# EAGLE schematic Opto Board (EAGLE 6.4)
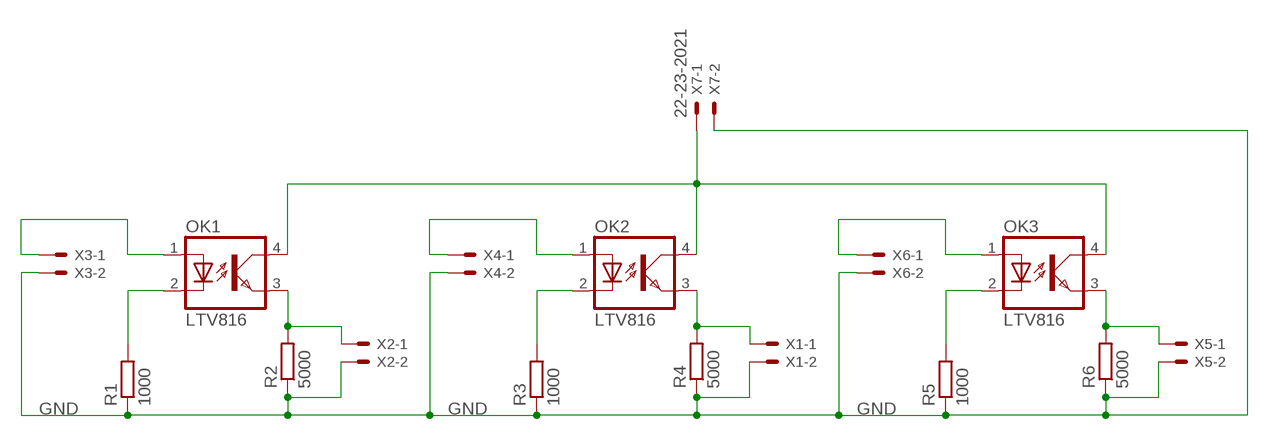
[diagram p0: schematic, sheet 1]

## Parts
OK1  LTV816  [DIL04]
OK2  LTV816  [DIL04]
OK3  LTV816  [DIL04]
R1  1000  R-EU_0204/7  [0204/7]
R2  5000  R-EU_0204/7  [0204/7]
R3  1000  R-EU_0204/7  [0204/7]
R4  5000  R-EU_0204/7  [0204/7]
R5  1000  R-EU_0204/7  [0204/7]
R6  5000  R-EU_0204/7  [0204/7]
X1  22-23-2021  [22-23-2021]
X2  22-23-2021  [22-23-2021]
X3  22-23-2021  [22-23-2021]
X4  22-23-2021  [22-23-2021]
X5  22-23-2021  [22-23-2021]
X6  22-23-2021  [22-23-2021]
X7  22-23-2021  [22-23-2021]

## Nets
GND [GND]: R1.1 R2.1 R3.1 R4.1 R5.1 R6.1 X1.2 X2.2 X3.2 X4.2 X5.2 X6.2 X7.2
N$1: OK1.1(A) X3.1
N$2: OK1.2(C) R1.2
N$3: OK2.1(A) X4.1
N$4: OK3.1(A) X6.1
N$5: OK2.2(C) R3.2
N$6: OK1.3(EMIT) R2.2 X2.1
N$7: OK3.2(C) R5.2
N$8: OK2.3(EMIT) R4.2 X1.1
N$9: OK3.3(EMIT) R6.2 X5.1
N$10: OK1.4(COL) OK2.4(COL) OK3.4(COL) X7.1

## Library data of the parts
OK1-OK3 = optocoupler:LTV816: OPTO COUPLER Source: LITEON, LTV816.pdf; OC_FARNELL: unknown; OC_NEWARK: unknown
R1-R6 = rcl:R-EU_: RESISTOR, European symbol
X1-X7 = con-molex:22-23-2021: .100" (2.54mm) Center Header - 2 Pin; MF: MOLEX; MPN: 22-23-2021; OC_FARNELL: 1462926; OC_NEWARK: 25C3832

## Net classes
1 GND: width 0.61 mm, drill 0.61 mm, clearance 0.61 mm